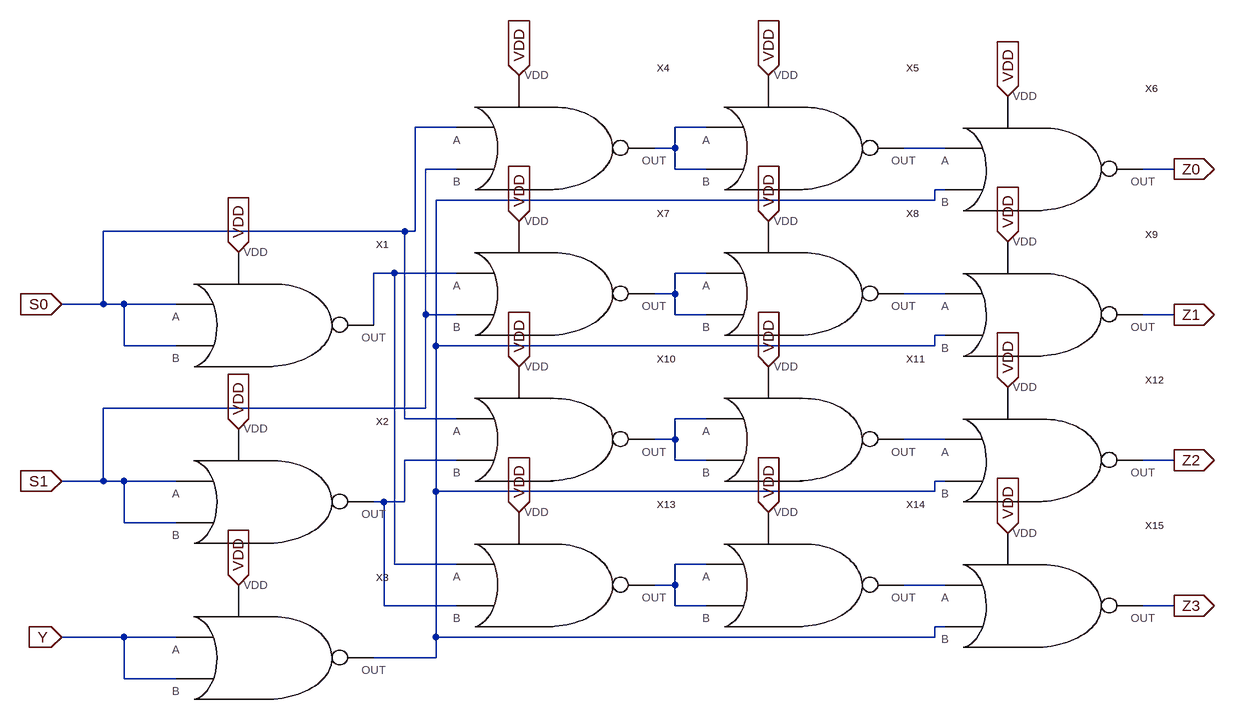
[diagram p0: schematic demultiplexer_1_to_4.asc]
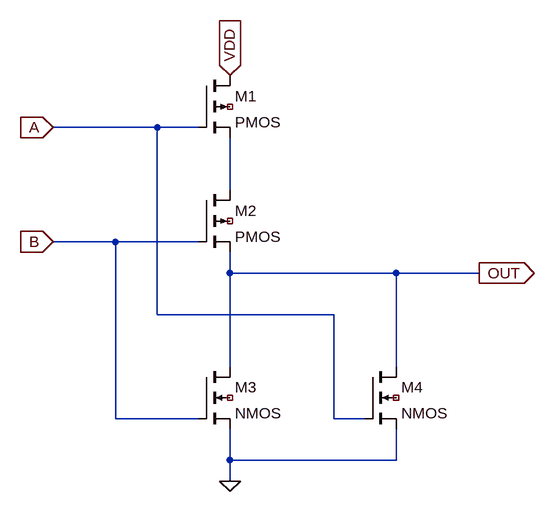
[diagram p1: sub-circuit cmos_nor.asc]
demultiplexer_1_to_4.asc, the LTspice schematic file:
Version 4
SHEET 1 2168 760
WIRE 656 -144 592 -144
WIRE 1040 -144 992 -144
WIRE 992 -112 992 -144
WIRE 992 -112 960 -112
WIRE 1408 -112 1344 -112
WIRE 656 -80 608 -80
WIRE 992 -80 992 -112
WIRE 1040 -80 992 -80
WIRE 1760 -80 1712 -80
WIRE 1408 -48 1392 -48
WIRE 1392 -32 1392 -48
WIRE 1392 -32 624 -32
WIRE 576 16 112 16
WIRE 592 16 592 -144
WIRE 592 16 576 16
WIRE 560 80 528 80
WIRE 656 80 560 80
WIRE 1040 80 992 80
WIRE 992 112 992 80
WIRE 992 112 960 112
WIRE 1408 112 1344 112
WIRE 112 128 112 16
WIRE 112 128 48 128
WIRE 144 128 112 128
WIRE 224 128 144 128
WIRE 608 144 608 -80
WIRE 656 144 608 144
WIRE 992 144 992 112
WIRE 1040 144 992 144
WIRE 1760 144 1712 144
WIRE 528 160 528 80
WIRE 1408 176 1392 176
WIRE 144 192 144 128
WIRE 224 192 144 192
WIRE 624 192 624 -32
WIRE 1392 192 1392 176
WIRE 1392 192 624 192
WIRE 608 288 608 144
WIRE 608 288 112 288
WIRE 576 304 576 16
WIRE 656 304 576 304
WIRE 1040 304 992 304
WIRE 992 336 992 304
WIRE 992 336 960 336
WIRE 1408 336 1344 336
WIRE 656 368 576 368
WIRE 992 368 992 336
WIRE 1040 368 992 368
WIRE 1760 368 1712 368
WIRE 112 400 112 288
WIRE 112 400 48 400
WIRE 144 400 112 400
WIRE 224 400 144 400
WIRE 1408 400 1392 400
WIRE 624 416 624 192
WIRE 1392 416 1392 400
WIRE 1392 416 624 416
WIRE 544 432 528 432
WIRE 576 432 576 368
WIRE 576 432 544 432
WIRE 144 464 144 400
WIRE 224 464 144 464
WIRE 560 528 560 80
WIRE 656 528 560 528
WIRE 1040 528 992 528
WIRE 992 560 992 528
WIRE 992 560 960 560
WIRE 1408 560 1344 560
WIRE 544 592 544 432
WIRE 656 592 544 592
WIRE 992 592 992 560
WIRE 1040 592 992 592
WIRE 1760 592 1712 592
WIRE 1408 624 1392 624
WIRE 144 640 48 640
WIRE 224 640 144 640
WIRE 624 640 624 416
WIRE 1392 640 1392 624
WIRE 1392 640 624 640
WIRE 624 672 624 640
WIRE 624 672 528 672
WIRE 144 704 144 640
WIRE 224 704 144 704
FLAG 48 128 S0
IOPIN 48 128 In
FLAG 48 400 S1
IOPIN 48 400 In
FLAG 48 640 Y
IOPIN 48 640 In
FLAG 320 48 VDD
IOPIN 320 48 In
FLAG 320 320 VDD
IOPIN 320 320 In
FLAG 320 560 VDD
IOPIN 320 560 In
FLAG 1760 -80 Z0
IOPIN 1760 -80 Out
FLAG 752 -224 VDD
IOPIN 752 -224 In
FLAG 1136 -224 VDD
IOPIN 1136 -224 In
FLAG 1504 -192 VDD
IOPIN 1504 -192 In
FLAG 1760 144 Z1
IOPIN 1760 144 Out
FLAG 752 0 VDD
IOPIN 752 0 In
FLAG 1136 0 VDD
IOPIN 1136 0 In
FLAG 1504 32 VDD
IOPIN 1504 32 In
FLAG 1760 368 Z2
IOPIN 1760 368 Out
FLAG 752 224 VDD
IOPIN 752 224 In
FLAG 1136 224 VDD
IOPIN 1136 224 In
FLAG 1504 256 VDD
IOPIN 1504 256 In
FLAG 1760 592 Z3
IOPIN 1760 592 Out
FLAG 752 448 VDD
IOPIN 752 448 In
FLAG 1136 448 VDD
IOPIN 1136 448 In
FLAG 1504 480 VDD
IOPIN 1504 480 In
SYMBOL cmos_nor 336 160 R0
SYMATTR InstName X1
SYMBOL cmos_nor 336 432 R0
SYMATTR InstName X2
SYMBOL cmos_nor 336 672 R0
SYMATTR InstName X3
SYMBOL cmos_nor 768 -112 R0
SYMATTR InstName X4
SYMBOL cmos_nor 1152 -112 R0
SYMATTR InstName X5
SYMBOL cmos_nor 1520 -80 R0
SYMATTR InstName X6
SYMBOL cmos_nor 768 112 R0
SYMATTR InstName X7
SYMBOL cmos_nor 1152 112 R0
SYMATTR InstName X8
SYMBOL cmos_nor 1520 144 R0
SYMATTR InstName X9
SYMBOL cmos_nor 768 336 R0
SYMATTR InstName X10
SYMBOL cmos_nor 1152 336 R0
SYMATTR InstName X11
SYMBOL cmos_nor 1520 368 R0
SYMATTR InstName X12
SYMBOL cmos_nor 768 560 R0
SYMATTR InstName X13
SYMBOL cmos_nor 1152 560 R0
SYMATTR InstName X14
SYMBOL cmos_nor 1520 592 R0
SYMATTR InstName X15

cmos_nor.asc, the sub-circuit schematic file:
Version 4
SHEET 1 880 788
WIRE -1744 224 -1904 224
WIRE -1680 224 -1744 224
WIRE -1632 320 -1632 240
WIRE -1808 400 -1904 400
WIRE -1680 400 -1808 400
WIRE -1632 448 -1632 416
WIRE -1376 448 -1632 448
WIRE -1248 448 -1376 448
WIRE -1744 512 -1744 224
WIRE -1472 512 -1744 512
WIRE -1632 592 -1632 448
WIRE -1376 592 -1376 448
WIRE -1808 672 -1808 400
WIRE -1680 672 -1808 672
WIRE -1472 672 -1472 512
WIRE -1424 672 -1472 672
WIRE -1632 736 -1632 688
WIRE -1376 736 -1376 688
WIRE -1376 736 -1632 736
WIRE -1632 768 -1632 736
FLAG -1632 144 VDD
IOPIN -1632 144 In
FLAG -1904 224 A
IOPIN -1904 224 In
FLAG -1904 400 B
IOPIN -1904 400 In
FLAG -1248 448 OUT
IOPIN -1248 448 Out
FLAG -1632 768 0
SYMBOL pmos4 -1680 320 R0
SYMATTR InstName M2
SYMBOL pmos4 -1680 144 R0
SYMATTR InstName M1
SYMBOL nmos4 -1680 592 R0
SYMATTR InstName M3
SYMBOL nmos4 -1424 592 R0
SYMATTR InstName M4

The netlist it stands for:
* demultiplexer_1_to_4.asc
XX1 N004 VDD S0 S0 cmos_nor
XX2 N009 VDD S1 S1 cmos_nor
XX3 N003 VDD Y Y cmos_nor
XX4 N001 VDD S0 S1 cmos_nor
XX5 N002 VDD N001 N001 cmos_nor
XX6 Z0 VDD N002 N003 cmos_nor
XX7 N005 VDD N004 S1 cmos_nor
XX8 N006 VDD N005 N005 cmos_nor
XX9 Z1 VDD N006 N003 cmos_nor
XX10 N007 VDD S0 N009 cmos_nor
XX11 N008 VDD N007 N007 cmos_nor
XX12 Z2 VDD N008 N003 cmos_nor
XX13 N010 VDD N004 N009 cmos_nor
XX14 N011 VDD N010 N010 cmos_nor
XX15 Z3 VDD N011 N003 cmos_nor

* block symbol definitions
.subckt cmos_nor OUT VDD A B
M2 N001 B OUT NC_01 PMOS
M1 VDD A N001 NC_02 PMOS
M3 OUT B 0 NC_03 NMOS
M4 OUT A 0 NC_04 NMOS
.ends cmos_nor

.model NMOS NMOS
.model PMOS PMOS
.lib standard.mos
.backanno
.end